# EAGLE design Famicom_PWR_AV_Board (EAGLE 9.0.0)
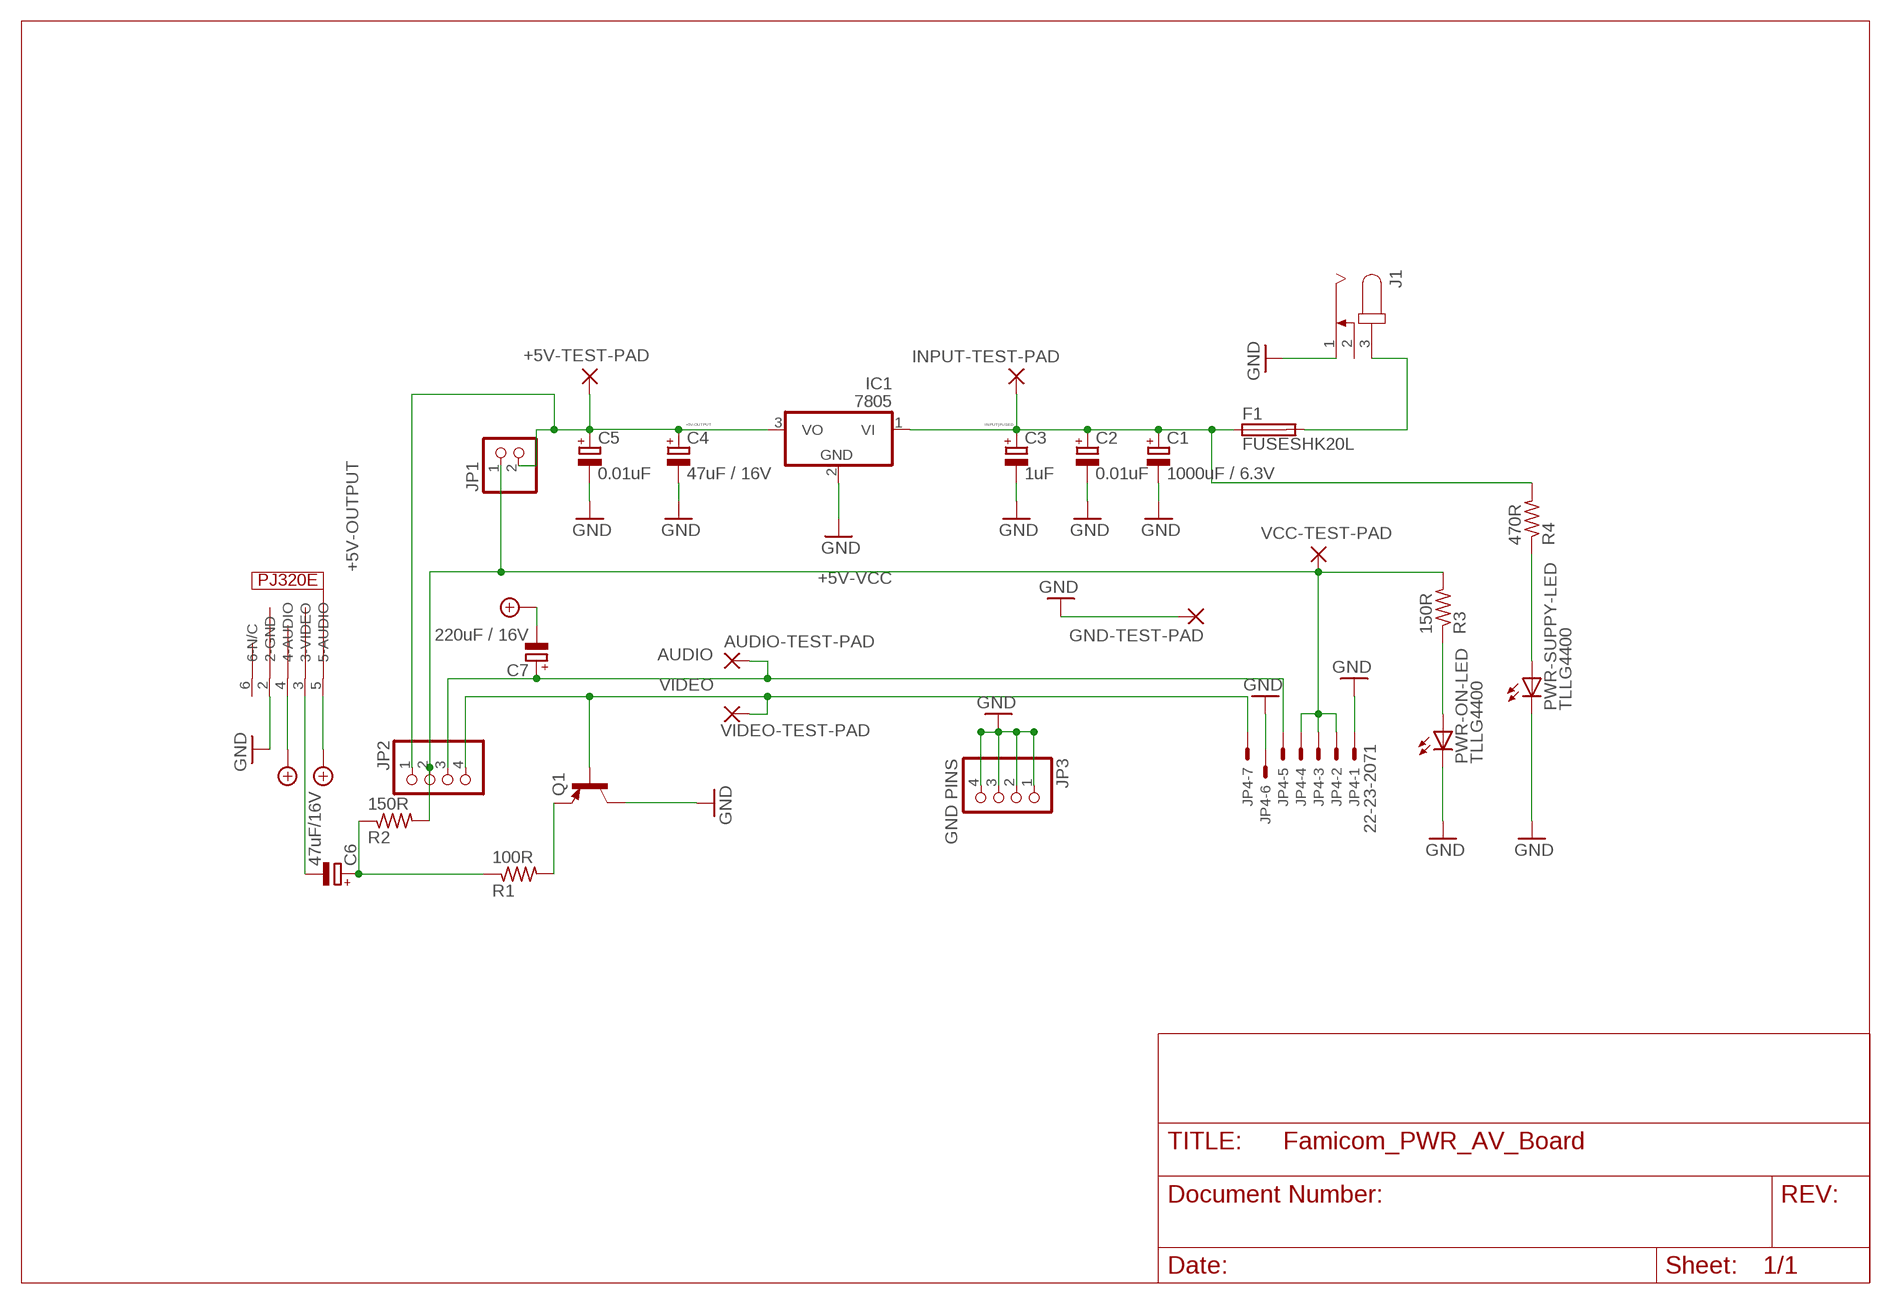
[diagram p0: schematic, sheet 1]

## Parts
+5V-TEST-PAD  WIREPAD2,15/1,0  [2,15/1,0]
AUDIO-TEST-PAD  WIREPAD2,15/1,0  [2,15/1,0]
C1  1000uF / 6.3V  CPOL-EUTAP5-45  [TAP5-45]
C2  0.01uF  CPOL-EUTAP5-45  [TAP5-45]
C3  1uF  CPOL-EUTAP5-45  [TAP5-45]
C4  47uF / 16V  CPOL-EUTAP5-45  [TAP5-45]
C5  0.01uF  CPOL-EUTAP5-45  [TAP5-45]
C6  47uF/16V  CPOL-EUTAP5-45  [TAP5-45]
C7  220uF / 16V  CPOL-EUTAP5-45  [TAP5-45]
F1  FUSESHK20L  [SHK20L]
GND-TEST-PAD  WIREPAD2,15/1,0  [2,15/1,0]
IC1  7805  7805TV  [TO220V]
INPUT-TEST-PAD  WIREPAD2,15/1,0  [2,15/1,0]
J1  JACK-PLUG0  [SPC4077]
JP1  PINHD-1X2  [1X02]
JP2  PINHD-1X4  [1X04]
JP3  GND PINS  PINHD-1X4  [1X04]
JP4  22-23-2071  [22-23-2071]
PWR-ON-LED  TLLG4400  [LED3MM]
PWR-SUPPY-LED  TLLG4400  [LED3MM]
Q1  MPSA56-TO92  [TO92-CBE]
R1  100R  R-US_0204/7  [0204/7]
R2  150R  R-US_0204/7  [0204/7]
R3  150R  R-US_0204/7  [0204/7]
R4  470R  R-US_0204/7  [0204/7]
U$2  PJ320E  [PJ320E]
VCC-TEST-PAD  WIREPAD2,15/1,0  [2,15/1,0]
VIDEO-TEST-PAD  WIREPAD2,15/1,0  [2,15/1,0]

## Nets
+5V-OUTPUT: +5V-TEST-PAD.1(P) C4.+ C5.+ IC1.3(VO) JP1.2 JP2.1
+5V-VCC: JP1.1 JP2.2 JP4.2 JP4.3 JP4.4 R2.2 R3.2 VCC-TEST-PAD.1(P)
+9V-INPUT-UNFUSED: F1.2A J1.3
AUDIO: AUDIO-TEST-PAD.1(P) C7.+ JP2.3 JP4.5
AUDIO_OUTPUT: C7.- U$2.4(4-AUDIO) U$2.5(5-AUDIO) ; supply symbol labelled +5V
GND: C1.- C2.- C3.- C4.- C5.- GND-TEST-PAD.1(P) IC1.2(GND) J1.1 JP3.1 JP3.2 JP3.3 JP3.4 JP4.1 JP4.6 PWR-ON-LED.K(C) PWR-SUPPY-LED.K(C) Q1.C U$2.2(2-GND)
INPUT|FUSED: C1.+ C2.+ C3.+ F1.1A IC1.1(VI) INPUT-TEST-PAD.1(P) R4.2
ON_LED: PWR-ON-LED.A R3.1
SUPPLY_LED: PWR-SUPPY-LED.A R4.1
VIDEO: JP2.4 JP4.7 Q1.B VIDEO-TEST-PAD.1(P)
VIDEO_AMP: C6.+ R1.1 R2.1
VIDEO_OUTPUT: C6.- U$2.3(3-VIDEO)
VIDEO_PREAMP: Q1.E R1.2
Unconnected: J1.2 U$2.6(6-N/C)

## Library data of the parts
+5V-TEST-PAD AUDIO-TEST-PAD GND-TEST-PAD INPUT-TEST-PAD VCC-TEST-PAD VIDEO-TEST-PAD = wirepad:WIREPAD: Wire PAD connect wire on PCB
C1-C7 = rcl:CPOL-EU: POLARIZED CAPACITOR, European symbol; SPICEPREFIX: C
F1 = fuse:FUSE: Fuse; OC_FARNELL: unknown; OC_NEWARK: unknown
IC1 = linear:78*: Positive VOLTAGE REGULATOR Source: http://cache.national.com/ds/LM/LM78L05.pdf http://www.fairchildsemi.com/ds/LM/LM7805.pdf
J1 = con-jack:JACK-PLUG: DC POWER JACK Power Jack, DC, Right Angle, Through Hole, Rated 5A at 16VDC, PC Terminals Distributor: Farnell (www.Farnell.de) Drawing: 84N1161.pdf / 84N1162.pdf Manufacturer: SPC Technology (www.spctechnology.com) Type: SPC4077 / SPC 4078; OC_FARNELL: unknown; OC_NEWARK: unknown
JP1 = pinhead:PINHD-1X2: PIN HEADER
JP2 JP3 = pinhead:PINHD-1X4: PIN HEADER
JP4 = con-molex:22-23-2071: .100" (2.54mm) Center Header - 7 Pin; MF: MOLEX; MPN: 22-23-2071; OC_FARNELL: 1654534; OC_NEWARK: 56H0445
PWR-ON-LED PWR-SUPPY-LED = led:TLLG4400: Low Current (2mA) LED 3 mm Tinted Diffused Package color GREEN Source: Data sheet <http://www.farnell.com/datasheets/391098.pdf>; MF: VISHAY SEMICONDUCTOR; OC_FARNELL: 1612435
Q1 = transistor-pnp:*-?: PNP Transistor
R1-R4 = rcl:R-US_: RESISTOR, American symbol; SPICEPREFIX: R
U$2 = PJ320E:PJ320E

## Board
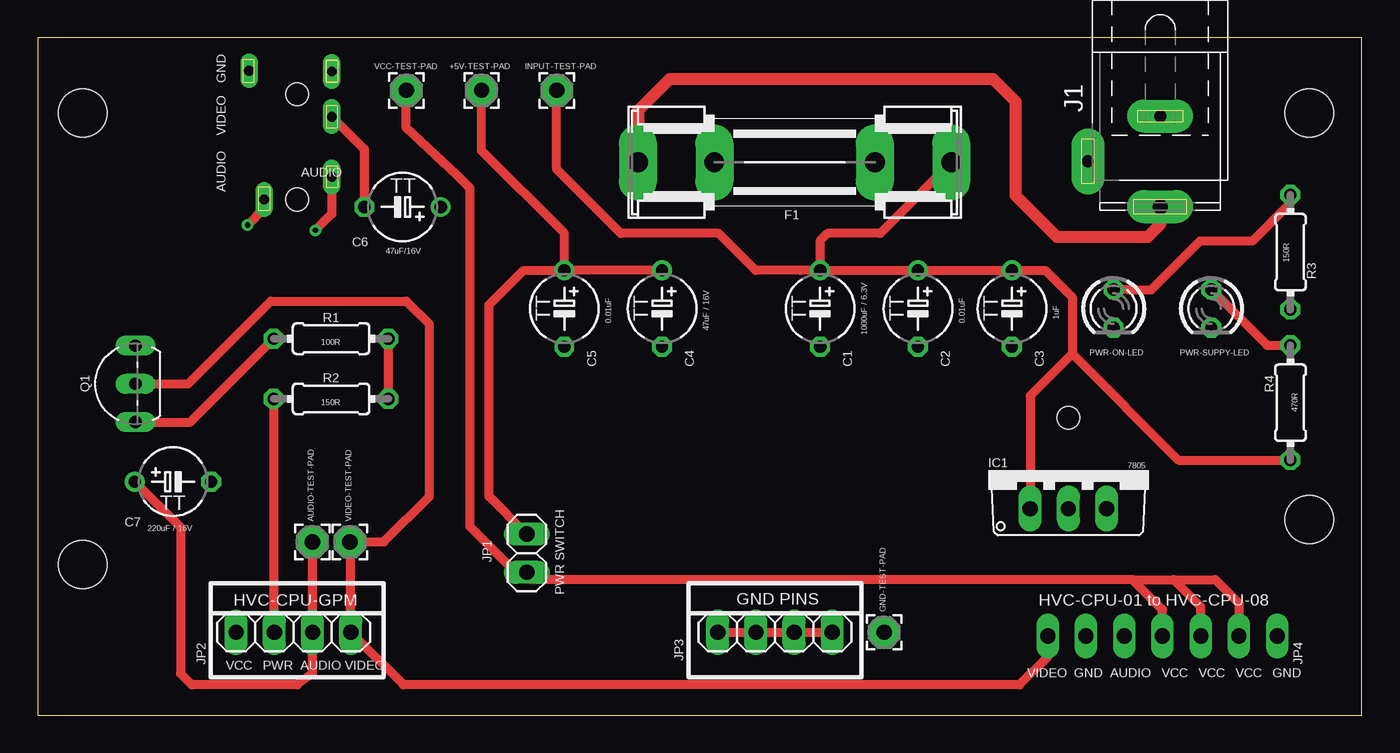
[diagram p1: board, top side]
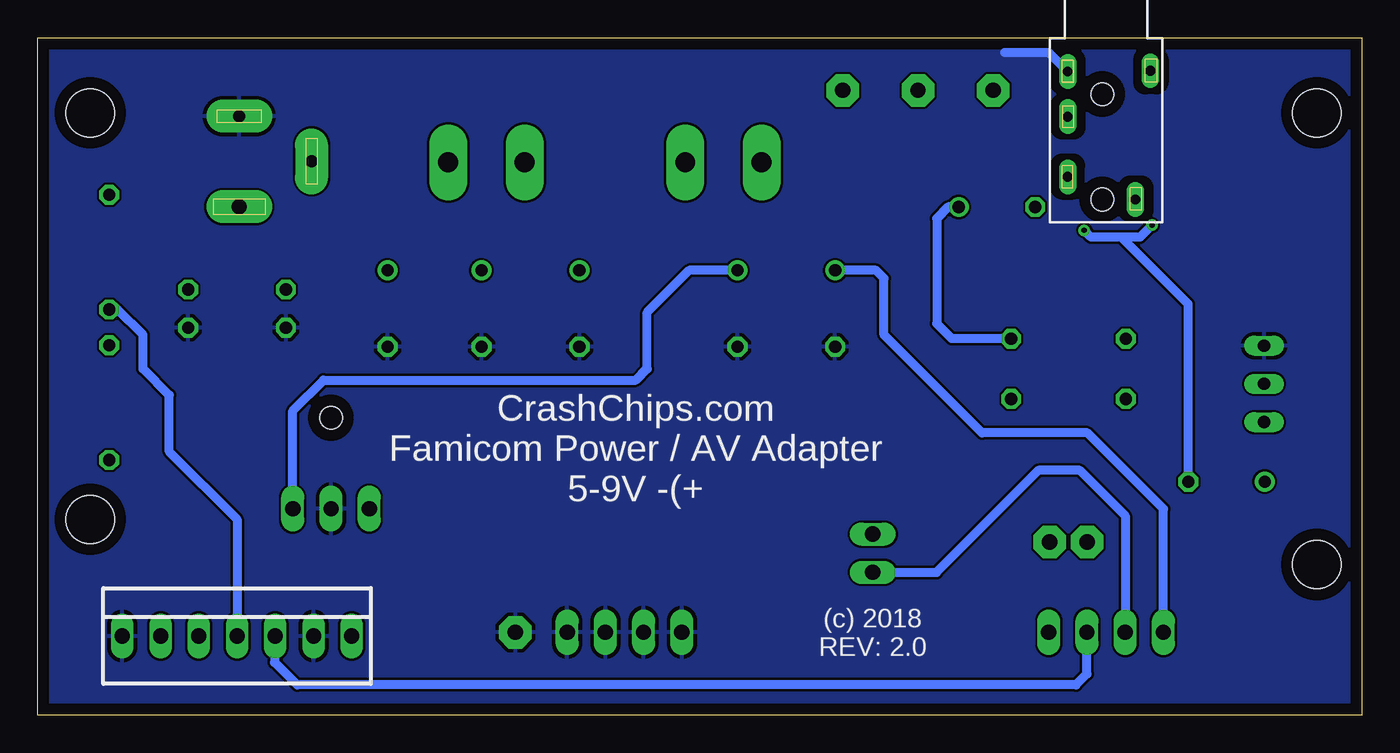
[diagram p2: board, bottom side, seen from below]

Size 88 x 45 mm. Coordinates in mm from the lower left corner, seen from the top.
Outline: 0,0 88,0 88,45 0,45 0,0
Copper layers (1*16): Top 0.035mm / dielectric 1.5mm / Bottom 0.035mm
Design rules "PCBWay2LayerRules": minimum track width 6mil, minimum drill 0.3mm, track to track 6mil, track to pad 6mil, pad to pad 6mil, via to via 6mil, smd to smd 6mil, copper to edge 30mil, drill to drill 6mil, minimum pad ring 10mil, minimum via ring 8mil, stop-mask expansion 4mil, vias tented up to drill 0mil, thermal gap 10mil
Holes 3.2 mm at 3,40 84.5,40 84.5,13 3,10
Holes 1.5 mm at 68.5,19.75

### Footprints (pad centres in the part's own frame; a part is rotated, then mirrored left to right if it is on the bottom)
2,15/1,0 = drill 1.016 pad 2.159 octagon: 1 0,0
TAP5-45 = drill 0.813: + -2.54,0 | drill 0.813 octagon: - 2.54,0
SHK20L = drill 1.321 pad 2.54 long: 1A -10.414,0; 1B -5.334,0; 2A 10.414,0; 2B 5.334,0
TO220V = drill 1.016 long: 1 -2.54,-2.54; 2 0,-2.54; 3 2.54,-2.54
SPC4077 = drill 0.8 pad 2.184 long: 1 -3,0; 2 0,-4.8 | drill 1 pad 2.184 long: 3 3,0
1X02 = drill 1.016 long: 1 -1.27,0; 2 1.27,0
1X04 = drill 1.016 long: 1 -3.81,0; 2 -1.27,0; 3 1.27,0; 4 3.81,0
22-23-2071 = drill 1 long: 1 -7.62,0; 2 -5.08,0; 3 -2.54,0; 4 0,0; 5 2.54,0; 6 5.08,0; 7 7.62,0
LED3MM = drill 0.813 octagon: A -1.27,0; K 1.27,0
TO92-CBE = drill 0.813 long: B 0,0; C 2.54,0; E -2.54,0
0204/7 = drill 0.813 octagon: 1 -3.81,0; 2 3.81,0
PJ320E = drill 0.65 long: 2 5,1.2; 3 8,1.2; 4 12,1.2; 5 13.5,5.7; 6 4.95,6.7 | hole 1.5: 6.5,3.5; 13.5,3.5

### Placement (x,y rotation side)
+5V-TEST-PAD  29.5,41.5 0 top
AUDIO-TEST-PAD  18.25,11.5 0 top
C1  52,27 270 top
C2  58.5,27 270 top
C3  64.75,27 270 top
C4  41.5,27 270 top
C5  35,27 270 top
C6  24.25,33.75 180 top
C7  9,15.5 0 top
F1  50.3,36.71 180 top
GND-TEST-PAD  56.25,5.5 0 top
IC1  68.5,16.25 0 top
INPUT-TEST-PAD  34.5,41.5 0 top
J1  74.6,36.78 270 top
JP1  32.5,10.75 90 top
JP2  17,5.5 0 top
JP3  49,5.5 0 top
JP4  74.75,5.25 0 bottom
PWR-ON-LED  71.5,27 270 top
PWR-SUPPY-LED  78,27 270 top
Q1  6.5,22 90 top
R1  19.5,25 180 top
R2  19.5,21 180 top
R3  83.25,30.75 270 top
R4  83.25,20.75 270 top
U$2  20.75,47.75 270 bottom
VCC-TEST-PAD  24.5,41.5 0 top
VIDEO-TEST-PAD  20.75,11.5 0 top

### Tracks (layer width: path | path; a pad name or v marks a point on that pad's centre or on a via)
+5V-OUTPUT
  Top 0.61: C4.+ C5.+ | C5.+ 34.96,29.5 32.25,29.5 30,27.25 30,14.52 JP1.2 | C5.+ 35,32 29.5,37.5 +5V-TEST-PAD.1
  Bottom 0.61: JP2.1 13.19,13.69 18.25,18.75 25.25,18.75 31.75,25.25 31.75,29 32.29,29.54 C5.+ | C4.+ 44.71,29.54 47.5,26.75 47.5,23 48.25,22.25 69,22.25 71.04,20.21 IC1.3
+5V-VCC
  Top 0.61: R2.2 15.69,5.54 JP2.2 | JP4.2 79.83,7.42 78.25,9 75.5,9 | 72.75,9 75.5,9 | JP4.3 77.29,7.21 75.5,9 | JP4.4 74.75,7 72.75,9 | VCC-TEST-PAD.1 24.5,39 27.87,35.88 28.73,35.01 28.73,12.52 31.77,9.48 32.25,9.48 | 32.25,9.48 JP1.1 | 32.25,9.48 32.73,9 72.75,9
  Bottom 0.61: JP2.2 15.73,13.23 18.75,16.25 21.5,16.25 28.27,9.48 JP1.1 | JP4.4 74.75,13 79.25,17.5 79.25,21.25 81,23 81,25.25 82.69,26.94 R3.2
+9V-INPUT-UNFUSED
  Top 0.813: J1.3 74.6,32.6 73.75,31.75 67.75,31.75 65,34.5 65,40.75 63.5,42.25 42,42.25 39.89,40.14 F1.2A
AUDIO
  Top 0.61: AUDIO-TEST-PAD.1 18.27,11.48 JP2.3 18.27,2.77 17.25,2 10.25,2 9.5,2.75 9.5,12.46 C7.+
  Bottom 0.61: JP2.3 18.27,2.73 19,2 70.75,2 72.25,3.5 72.25,5.21 JP4.5
AUDIO_OUTPUT  (via drill 0.35)
  Top 0.61: U$2.5 15.05,33.65 v13.95,32.55 | U$2.4 19.55,33.3 v18.45,32.2
  Bottom 0.61: C7.- 11.54,27.29 16,31.75 | 16,31.75 18,31.75 v18.45,32.2 | 16,31.75 14.75,31.75 v13.95,32.55
GND
  Top 0.61: JP3.1 JP3.4 53,5.69
  Bottom 0.61: U$2.2 20.8,44 23.75,44
  pour Bottom: 0,45 88,45 88,0 0,0
INPUT|FUSED
  Top 0.61: 52,29.75 C1.+ | C1.+ C2.+ C3.+ 66.96,29.54 68.75,27.75 68.75,24 | C1.+ 50.71,29.54 | F1.1A 56,32 52.5,32 52,31.5 C1.+ | C1.+ 47.71,29.54 45.25,32 38.75,32 34.5,36.25 INPUT-TEST-PAD.1 | 68.75,24 75.81,16.94 R4.2 | 68.75,24 65.96,21.21 IC1.1
ON_LED
  Top 0.61: PWR-ON-LED.A 72.5,28.25 74,28.25 77.25,31.5 80.75,31.5 83.25,34 R3.1
SUPPLY_LED
  Top 0.61: PWR-SUPPY-LED.A 81.71,24.56 R4.1
VIDEO
  Top 0.61: Q1.B 10,22 15.5,27.5 24.5,27.5 26,26 26,14.5 23,11.5 VIDEO-TEST-PAD.1 20.95,11.6 20.81,11.47 JP2.4 24.31,2 65.25,2 67.13,3.88 JP4.7
VIDEO_AMP
  Top 0.61: R2.1 R1.1
  Bottom 0.61: R1.1 27.25,25 28.25,26 28.25,33 27.5,33.75 C6.+
VIDEO_OUTPUT
  Top 0.61: U$2.3 21.71,37.59 C6.-
VIDEO_PREAMP
  Top 0.61: Q1.E 10.15,19.46 R1.2

### Text on the board
tPlace: GND | VIDEO | AUDIO | AUDIO | PWR SWITCH | HVC-CPU-GPM | HVC-CPU-01 to HVC-CPU-08 | VCC PWR AUDIO VIDEO | VIDEO GND AUDIO VCC VCC VCC GND
bNames: CrashChips.com / Famicom Power / AV Adapter / 5-9V -(+ | (c) 2018 / REV: 2.0